# Altium project FPC_ADAPTOR.PrjPcb
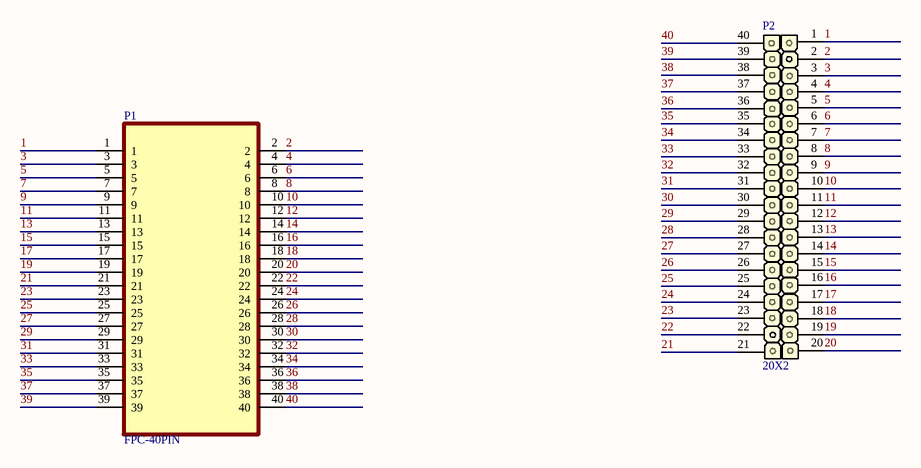
[diagram p0: FPC_ADAPTOR.SchDoc]
1 sheet, 2 parts. Net scope: global (net labels, ports and power ports of the same name join across sheets).
Board file: FPC_ADAPTOR.PcbDoc

## Sheet FPC_ADAPTOR.SchDoc
size A4

### Parts
P1  FPC-40PIN  [FPC-40PIN-0.5MM]
P2  20X2  [2X20_FPC]

### Nets
1: P1.1 P2.1
2: P1.2 P2.2
3: P1.3 P2.3
4: P1.4 P2.4
5: P1.5 P2.5
6: P1.6 P2.6
7: P1.7 P2.7
8: P1.8 P2.8
9: P1.9 P2.9
10: P1.10 P2.10
11: P1.11 P2.11
12: P1.12 P2.12
13: P1.13 P2.13
14: P1.14 P2.14
15: P1.15 P2.15
16: P1.16 P2.16
17: P1.17 P2.17
18: P1.18 P2.18
19: P1.19 P2.19
20: P1.20 P2.20
21: P1.21 P2.21
22: P1.22 P2.22
23: P1.23 P2.23
24: P1.24 P2.24
25: P1.25 P2.25
26: P1.26 P2.26
27: P1.27 P2.27
28: P1.28 P2.28
29: P1.29 P2.29
30: P1.30 P2.30
31: P1.31 P2.31
32: P1.32 P2.32
33: P1.33 P2.33
34: P1.34 P2.34
35: P1.35 P2.35
36: P1.36 P2.36
37: P1.37 P2.37
38: P1.38 P2.38
39: P1.39 P2.39
40: P1.40 P2.40

### Library data of the parts
P2 = 20X2: Value: 20x2 header